# EAGLE schematic charge (EAGLE 6.0)
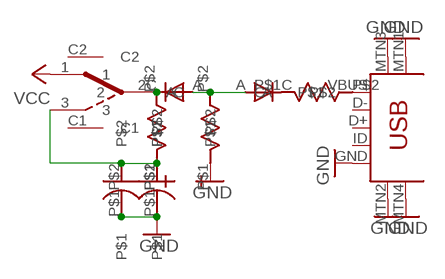
[diagram p0: schematic, sheet 1]

## Parts
U$1  R-7  [R-7]
U$2  NICHICON_12F  [NICHICON_10X30]
U$3  NICHICON_12F  [NICHICON_10X30]
U$5  D-6  [D-7.5]
U$6  SPST_PTH  [SWITCH2]
U$7  USB-MINIB-5PIN  [USB-MINIB]
U$8  R-7  [R-7]
U$9  D-6  [D-7.5]
U$10  R-7  [R-7]

## Nets
GND: U$2.P$1 U$3.P$1 U$7.GND U$7.MTN1(MTN2) U$7.MTN2(MTN3) U$7.MTN3(MTN1) U$7.MTN4 U$10.P$1
N$1: U$1.P$2 U$7.VBUS
N$2: U$1.P$1 U$5.C
N$3: U$5.A U$9.A U$10.P$2
N$4: U$2.P$2 U$3.P$2 U$6.3 U$8.P$1
N$5: U$6.2 U$8.P$2 U$9.C
VCC: U$6.1
Unconnected: U$6.C1 U$6.C2 U$7.D+ U$7.D- U$7.ID

## Library data of the parts
U$1 U$8 U$10 = Mrule:R-7
U$2 U$3 = Mrule:NICHICON_12F
U$5 U$9 = Mrule:D-6
U$6 = Mrule:SPST_PTH
U$7 = SparkFun-Connectors:USB-MINIB: Mini-USB "B" connector with 5th pin broken out. Created new symbol breaking out 5th "ID" pin in mini/micro USB connector spec. See: http://en.wikipedia.org/wiki/Mini_usb#Cables. Uses same footprint as 4-pin symbol. Also added pins to connect to mounting / shield pads if required (probably not generally needed as signals aren't shielded once they leave the connector).